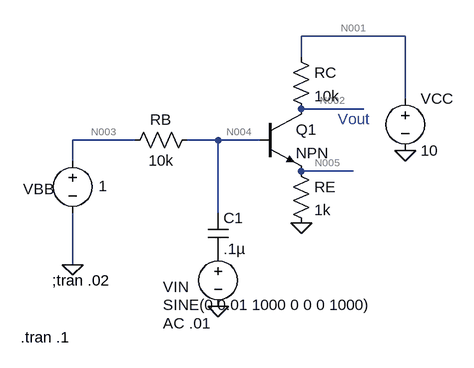
[diagram p0: schematic BJT_Amplifier.asc]
BJT_Amplifier.asc, the LTspice schematic file:
Version 4
SHEET 1 904 680
WIRE 432 0 272 0
WIRE 272 32 272 0
WIRE 432 96 432 0
WIRE 368 112 272 112
WIRE 16 160 -80 160
WIRE 144 160 96 160
WIRE 208 160 144 160
WIRE -80 192 -80 160
WIRE 352 208 272 208
WIRE 144 272 144 160
WIRE -80 352 -80 272
FLAG 272 288 0
FLAG 432 176 0
FLAG -80 352 0
FLAG 144 416 0
SYMBOL npn 208 112 R0
SYMATTR InstName Q1
SYMBOL res 256 192 R0
SYMATTR InstName RE
SYMATTR Value 1k
SYMBOL res 256 16 R0
SYMATTR InstName RC
SYMATTR Value 10k
SYMBOL voltage 432 80 R0
WINDOW 123 0 0 Left 0
WINDOW 39 0 0 Left 0
SYMATTR InstName VCC
SYMATTR Value 10
SYMBOL voltage 144 320 R0
WINDOW 0 -85 66 Left 2
WINDOW 3 -85 94 Left 2
WINDOW 123 -85 122 Left 2
WINDOW 39 0 0 Left 0
SYMATTR InstName VIN
SYMATTR Value SINE(0 0.01 1000 0 0 0 1000)
SYMATTR Value2 AC .01
SYMBOL voltage -80 176 R0
WINDOW 0 -76 59 Left 2
WINDOW 3 40 55 Left 2
WINDOW 123 0 0 Left 0
WINDOW 39 0 0 Left 0
SYMATTR InstName VBB
SYMATTR Value 1
SYMBOL res 112 144 R90
WINDOW 0 0 56 VBottom 2
WINDOW 3 32 56 VTop 2
SYMATTR InstName RB
SYMATTR Value 10k
SYMBOL cap 128 272 R0
SYMATTR InstName C1
SYMATTR Value .1µ
TEXT -112 376 Left 2 !;tran .02
TEXT 328 128 Left 2 ;Vout
TEXT -160 464 Left 2 !.tran .1

The netlist it stands for:
* BJT_Amplifier.asc
Q1 N002 N004 N005 0 NPN
RE N005 0 1k
RC N001 N002 10k
VCC N001 0 10
VIN P001 0 SINE(0 0.01 1000 0 0 0 1000) AC .01
VBB N003 0 1
RB N004 N003 10k
C1 N004 P001 .1µ
.model NPN NPN
.model PNP PNP
.lib standard.bjt
;tran .02
* Vout
.tran .1
.backanno
.end

* Results of the author's LTspice run, read from the files saved beside the schematic
* Operating Point, zero values left out:
*   V(n002) = 7.631 V
*   V(n004) = 976.3 mV
*   V(n005) = 239.3 mV
*   V(n001) = 10 V
*   V(n003) = 1 V
*   Ic(Q1) = 236.9 µA
*   Ib(Q1) = 2.369 µA
*   Ie(Q1) = -239.3 µA
*   I(Re) = 239.3 µA
*   I(Rc) = 236.9 µA
*   I(Rb) = -2.369 µA
*   I(Vcc) = -236.9 µA
*   I(Vbb) = -2.369 µA
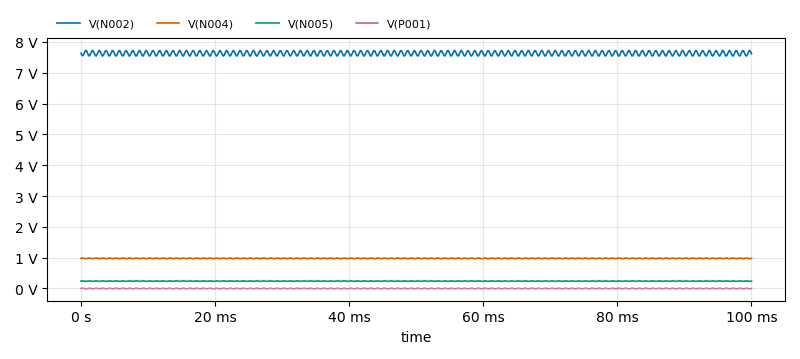
[diagram p1: Transient Analysis of BJT_Amplifier.asc, plotted from the saved traces]
* Transient Analysis, 1 run:
*   V(N002): min 7.543 V, max 7.725 V, average 7.631 V, rms 7.631 V, last 7.616 V
*   V(N004): min 965.7 mV, max 986.1 mV, average 976.3 mV, rms 976.3 mV, last 978 mV
*   V(N005): min 229.8 mV, max 248.2 mV, average 239.3 mV, rms 239.4 mV, last 240.8 mV
*   V(P001): min -10 mV, max 10 mV, average 42.21 nV, rms 7.185 mV, last 0 V